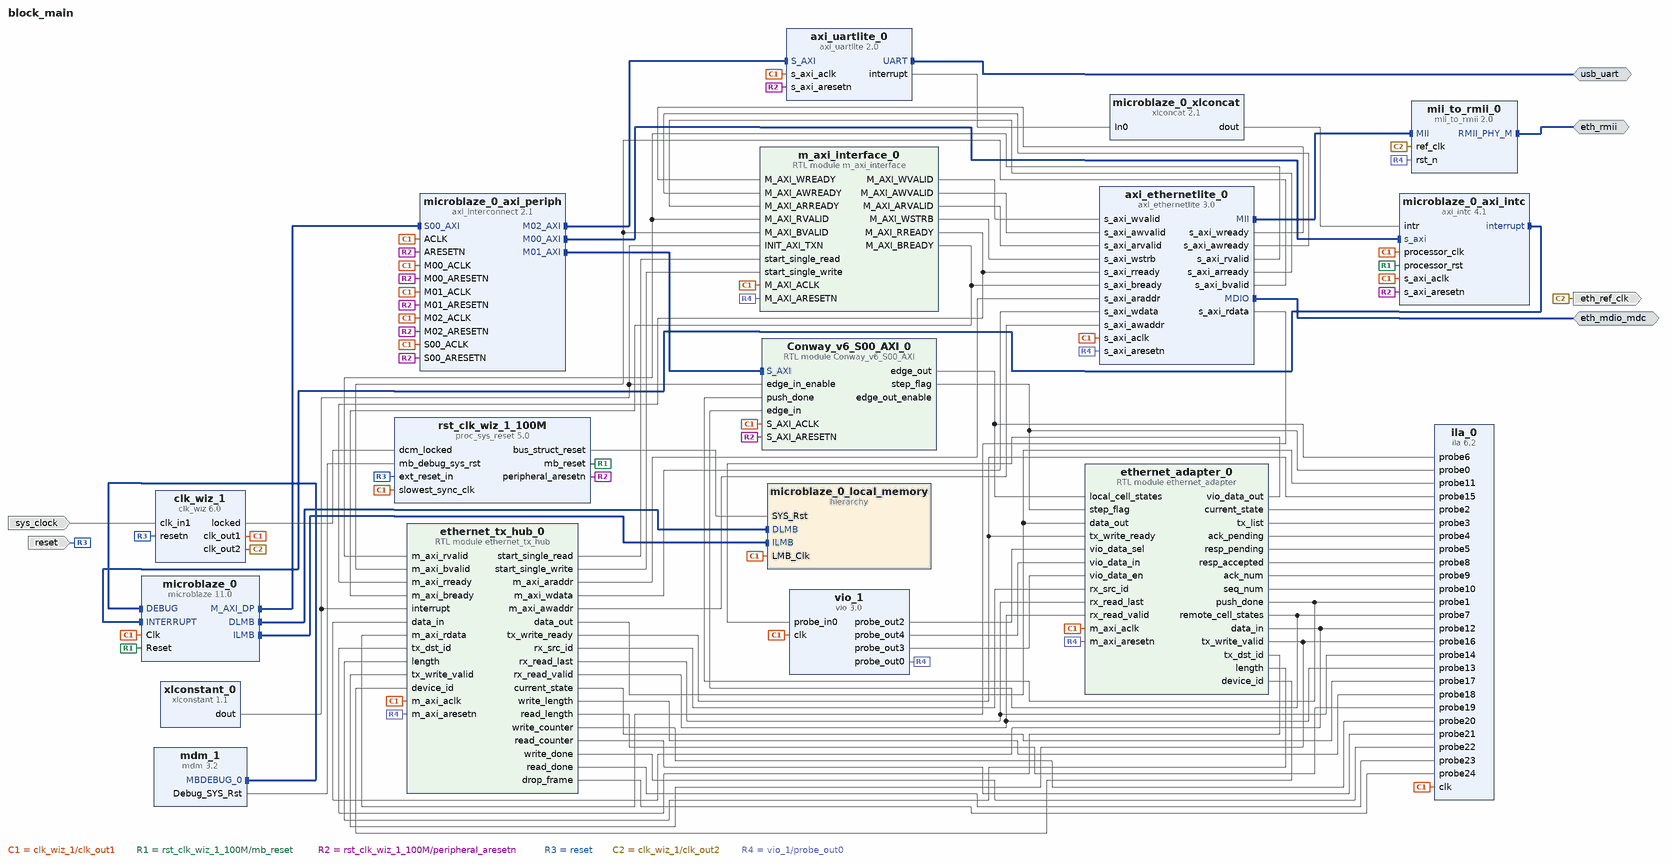
[diagram p0: block diagram of the top level]
# Vivado block design block_main, xc7a100tcsg324-1, Vivado 2018.3.1
create_bd_design block_main

create_bd_intf_port -mode Master -vlnv xilinx.com:interface:uart_rtl:1.0 usb_uart
create_bd_intf_port -mode Master -vlnv xilinx.com:interface:mdio_rtl:1.0 eth_mdio_mdc
create_bd_intf_port -mode Master -vlnv xilinx.com:interface:rmii_rtl:1.0 eth_rmii
create_bd_port -dir I -type rst reset
set_property -dict {CONFIG.POLARITY ACTIVE_LOW} [get_bd_ports reset]
create_bd_port -dir I -type clk sys_clock
set_property -dict {CONFIG.FREQ_HZ 100000000 CONFIG.PHASE 0.000} [get_bd_ports sys_clock]
create_bd_port -dir O -type clk eth_ref_clk

create_bd_cell -type ip -vlnv xilinx.com:ip:microblaze:11.0 microblaze_0
set_property -dict {CONFIG.C_DEBUG_ENABLED 1 CONFIG.C_D_AXI 1 CONFIG.C_D_LMB 1 CONFIG.C_I_LMB 1} [get_bd_cells microblaze_0]
create_bd_cell -type hier microblaze_0_local_memory
create_bd_cell -type ip -vlnv xilinx.com:ip:axi_interconnect:2.1 microblaze_0_axi_periph
set_property -dict {CONFIG.NUM_MI 3} [get_bd_cells microblaze_0_axi_periph]
create_bd_cell -type ip -vlnv xilinx.com:ip:axi_intc:4.1 microblaze_0_axi_intc
set_property -dict {CONFIG.C_HAS_FAST 1} [get_bd_cells microblaze_0_axi_intc]
create_bd_cell -type ip -vlnv xilinx.com:ip:xlconcat:2.1 microblaze_0_xlconcat
set_property -dict {CONFIG.NUM_PORTS 1} [get_bd_cells microblaze_0_xlconcat]
create_bd_cell -type ip -vlnv xilinx.com:ip:mdm:3.2 mdm_1
create_bd_cell -type ip -vlnv xilinx.com:ip:clk_wiz:6.0 clk_wiz_1
set_property -dict [list \
  CONFIG.CLKOUT2_JITTER 151.636 \
  CONFIG.CLKOUT2_PHASE_ERROR 98.575 \
  CONFIG.CLKOUT2_REQUESTED_OUT_FREQ 50.000 \
  CONFIG.CLKOUT2_USED true \
  CONFIG.CLK_IN1_BOARD_INTERFACE sys_clock \
  CONFIG.MMCM_CLKOUT1_DIVIDE 20 \
  CONFIG.MMCM_DIVCLK_DIVIDE 1 \
  CONFIG.NUM_OUT_CLKS 2 \
  CONFIG.PRIM_SOURCE Single_ended_clock_capable_pin \
  CONFIG.RESET_BOARD_INTERFACE reset \
  CONFIG.RESET_PORT resetn \
  CONFIG.RESET_TYPE ACTIVE_LOW \
  CONFIG.USE_BOARD_FLOW true \
] [get_bd_cells clk_wiz_1]
create_bd_cell -type ip -vlnv xilinx.com:ip:proc_sys_reset:5.0 rst_clk_wiz_1_100M
set_property -dict {CONFIG.RESET_BOARD_INTERFACE reset CONFIG.USE_BOARD_FLOW true} [get_bd_cells rst_clk_wiz_1_100M]
create_bd_cell -type ip -vlnv xilinx.com:ip:axi_uartlite:2.0 axi_uartlite_0
set_property -dict {CONFIG.UARTLITE_BOARD_INTERFACE usb_uart CONFIG.USE_BOARD_FLOW true} [get_bd_cells axi_uartlite_0]
create_bd_cell -type module -reference ethernet_tx_hub ethernet_tx_hub_0
create_bd_cell -type module -reference m_axi_interface m_axi_interface_0
create_bd_cell -type ip -vlnv xilinx.com:ip:axi_ethernetlite:3.0 axi_ethernetlite_0
set_property -dict [list \
  CONFIG.C_RX_PING_PONG 0 \
  CONFIG.C_TX_PING_PONG 0 \
  CONFIG.MDIO_BOARD_INTERFACE eth_mdio_mdc \
] [get_bd_cells axi_ethernetlite_0]
create_bd_cell -type ip -vlnv xilinx.com:ip:mii_to_rmii:2.0 mii_to_rmii_0
set_property -dict [list \
  CONFIG.REF_CLK_BOARD_INTERFACE sys_clock \
  CONFIG.RESET_BOARD_INTERFACE reset \
  CONFIG.RMII_BOARD_INTERFACE eth_rmii \
] [get_bd_cells mii_to_rmii_0]
create_bd_cell -type ip -vlnv xilinx.com:ip:vio:3.0 vio_1
set_property -dict [list \
  CONFIG.C_NUM_PROBE_OUT 5 \
  CONFIG.C_PROBE_OUT1_WIDTH 8 \
  CONFIG.C_PROBE_OUT2_WIDTH 4 \
  CONFIG.C_PROBE_OUT4_WIDTH 6 \
] [get_bd_cells vio_1]
create_bd_cell -type ip -vlnv xilinx.com:ip:xlconstant:1.1 xlconstant_0
set_property -dict {CONFIG.CONST_VAL 0} [get_bd_cells xlconstant_0]
create_bd_cell -type ip -vlnv xilinx.com:ip:ila:6.2 ila_0
set_property -dict [list \
  CONFIG.C_ENABLE_ILA_AXI_MON false \
  CONFIG.C_MONITOR_TYPE Native \
  CONFIG.C_NUM_OF_PROBES 25 \
  CONFIG.C_PROBE10_WIDTH 8 \
  CONFIG.C_PROBE11_WIDTH 32 \
  CONFIG.C_PROBE12_WIDTH 32 \
  CONFIG.C_PROBE17_WIDTH 4 \
  CONFIG.C_PROBE18_WIDTH 11 \
  CONFIG.C_PROBE19_WIDTH 11 \
  CONFIG.C_PROBE20_WIDTH 11 \
  CONFIG.C_PROBE21_WIDTH 13 \
  CONFIG.C_PROBE2_WIDTH 4 \
  CONFIG.C_PROBE3_WIDTH 8 \
  CONFIG.C_PROBE4_WIDTH 8 \
  CONFIG.C_PROBE6_WIDTH 10 \
  CONFIG.C_PROBE7_WIDTH 10 \
  CONFIG.C_PROBE9_WIDTH 8 \
] [get_bd_cells ila_0]
create_bd_cell -type module -reference Conway_v6_S00_AXI Conway_v6_S00_AXI_0
create_bd_cell -type module -reference ethernet_adapter ethernet_adapter_0

# ---- hierarchy /microblaze_0_local_memory ----
current_bd_instance /microblaze_0_local_memory
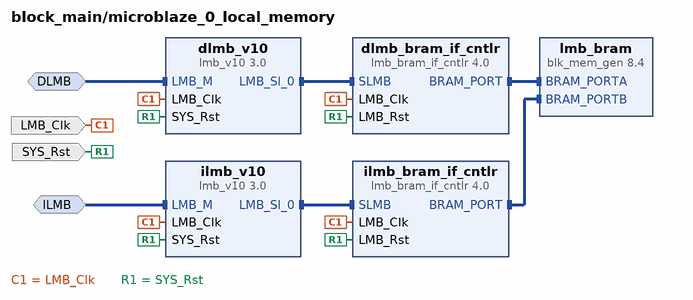
[diagram p1: block diagram inside /microblaze_0_local_memory]
create_bd_intf_pin -mode MirroredMaster -vlnv xilinx.com:interface:lmb_rtl:1.0 DLMB
create_bd_intf_pin -mode MirroredMaster -vlnv xilinx.com:interface:lmb_rtl:1.0 ILMB
create_bd_pin -dir I -type clk LMB_Clk
create_bd_pin -dir I -type rst SYS_Rst

create_bd_cell -type ip -vlnv xilinx.com:ip:lmb_v10:3.0 dlmb_v10
create_bd_cell -type ip -vlnv xilinx.com:ip:lmb_v10:3.0 ilmb_v10
create_bd_cell -type ip -vlnv xilinx.com:ip:lmb_bram_if_cntlr:4.0 dlmb_bram_if_cntlr
set_property -dict {CONFIG.C_ECC 0} [get_bd_cells dlmb_bram_if_cntlr]
create_bd_cell -type ip -vlnv xilinx.com:ip:lmb_bram_if_cntlr:4.0 ilmb_bram_if_cntlr
set_property -dict {CONFIG.C_ECC 0} [get_bd_cells ilmb_bram_if_cntlr]
create_bd_cell -type ip -vlnv xilinx.com:ip:blk_mem_gen:8.4 lmb_bram
set_property -dict {CONFIG.Memory_Type True_Dual_Port_RAM CONFIG.use_bram_block BRAM_Controller} [get_bd_cells lmb_bram]

# ---- connections ----

current_bd_instance /microblaze_0_local_memory
connect_bd_intf_net -intf_net microblaze_0_dlmb_cntlr [get_bd_intf_pins dlmb_bram_if_cntlr/BRAM_PORT] [get_bd_intf_pins lmb_bram/BRAM_PORTA]
connect_bd_intf_net -intf_net microblaze_0_ilmb_cntlr [get_bd_intf_pins ilmb_bram_if_cntlr/BRAM_PORT] [get_bd_intf_pins lmb_bram/BRAM_PORTB]
connect_bd_intf_net -intf_net microblaze_0_dlmb [get_bd_intf_pins DLMB] [get_bd_intf_pins dlmb_v10/LMB_M]
connect_bd_intf_net -intf_net microblaze_0_ilmb [get_bd_intf_pins ILMB] [get_bd_intf_pins ilmb_v10/LMB_M]
connect_bd_intf_net -intf_net microblaze_0_dlmb_bus [get_bd_intf_pins dlmb_v10/LMB_Sl_0] [get_bd_intf_pins dlmb_bram_if_cntlr/SLMB]
connect_bd_intf_net -intf_net microblaze_0_ilmb_bus [get_bd_intf_pins ilmb_v10/LMB_Sl_0] [get_bd_intf_pins ilmb_bram_if_cntlr/SLMB]
connect_bd_net -net microblaze_0_Clk [get_bd_pins LMB_Clk] \
  [get_bd_pins dlmb_v10/LMB_Clk] [get_bd_pins dlmb_bram_if_cntlr/LMB_Clk] [get_bd_pins ilmb_v10/LMB_Clk] \
  [get_bd_pins ilmb_bram_if_cntlr/LMB_Clk]
connect_bd_net [get_bd_pins SYS_Rst] \
  [get_bd_pins dlmb_v10/SYS_Rst] [get_bd_pins dlmb_bram_if_cntlr/LMB_Rst] [get_bd_pins ilmb_v10/SYS_Rst] \
  [get_bd_pins ilmb_bram_if_cntlr/LMB_Rst]
set_property HDL_ATTRIBUTE.BMM_INFO_ADDRESS_SPACE {byte  0x00000000 32 > block_main microblaze_0_local_memory/lmb_bram} [get_bd_cells dlmb_bram_if_cntlr]
set_property HDL_ATTRIBUTE.KEEP_HIERARCHY yes [get_bd_cells dlmb_bram_if_cntlr]

current_bd_instance /
connect_bd_intf_net [get_bd_intf_pins microblaze_0_axi_periph/M02_AXI] [get_bd_intf_pins axi_uartlite_0/S_AXI]
connect_bd_intf_net [get_bd_intf_ports usb_uart] [get_bd_intf_pins axi_uartlite_0/UART]
connect_bd_intf_net [get_bd_intf_pins axi_ethernetlite_0/MII] [get_bd_intf_pins mii_to_rmii_0/MII]
connect_bd_intf_net [get_bd_intf_ports eth_rmii] [get_bd_intf_pins mii_to_rmii_0/RMII_PHY_M]
connect_bd_intf_net [get_bd_intf_pins microblaze_0_axi_intc/interrupt] [get_bd_intf_pins microblaze_0/INTERRUPT]
connect_bd_intf_net [get_bd_intf_pins microblaze_0/DLMB] [get_bd_intf_pins microblaze_0_local_memory/DLMB]
connect_bd_intf_net [get_bd_intf_pins mdm_1/MBDEBUG_0] [get_bd_intf_pins microblaze_0/DEBUG]
connect_bd_intf_net -intf_net microblaze_0_intc_axi [get_bd_intf_pins microblaze_0_axi_periph/M00_AXI] [get_bd_intf_pins microblaze_0_axi_intc/s_axi]
connect_bd_intf_net [get_bd_intf_pins microblaze_0_axi_periph/M01_AXI] [get_bd_intf_pins Conway_v6_S00_AXI_0/S_AXI]
connect_bd_intf_net [get_bd_intf_ports eth_mdio_mdc] [get_bd_intf_pins axi_ethernetlite_0/MDIO]
connect_bd_intf_net -intf_net microblaze_0_axi_dp [get_bd_intf_pins microblaze_0_axi_periph/S00_AXI] [get_bd_intf_pins microblaze_0/M_AXI_DP]
connect_bd_intf_net [get_bd_intf_pins microblaze_0/ILMB] [get_bd_intf_pins microblaze_0_local_memory/ILMB]
connect_bd_net -net microblaze_0_intr [get_bd_pins microblaze_0_xlconcat/dout] [get_bd_pins microblaze_0_axi_intc/intr]
connect_bd_net -net microblaze_0_Clk [get_bd_pins clk_wiz_1/clk_out1] \
  [get_bd_pins microblaze_0/Clk] [get_bd_pins microblaze_0_axi_periph/ACLK] [get_bd_pins microblaze_0_axi_periph/S00_ACLK] \
  [get_bd_pins microblaze_0_axi_periph/M00_ACLK] [get_bd_pins microblaze_0_axi_intc/s_axi_aclk] \
  [get_bd_pins microblaze_0_axi_intc/processor_clk] [get_bd_pins microblaze_0_local_memory/LMB_Clk] \
  [get_bd_pins rst_clk_wiz_1_100M/slowest_sync_clk] [get_bd_pins microblaze_0_axi_periph/M01_ACLK] \
  [get_bd_pins axi_uartlite_0/s_axi_aclk] [get_bd_pins microblaze_0_axi_periph/M02_ACLK] \
  [get_bd_pins m_axi_interface_0/M_AXI_ACLK] [get_bd_pins ethernet_tx_hub_0/m_axi_aclk] \
  [get_bd_pins axi_ethernetlite_0/s_axi_aclk] [get_bd_pins vio_1/clk] [get_bd_pins ila_0/clk] \
  [get_bd_pins Conway_v6_S00_AXI_0/S_AXI_ACLK] [get_bd_pins ethernet_adapter_0/m_axi_aclk]
connect_bd_net [get_bd_pins clk_wiz_1/locked] [get_bd_pins rst_clk_wiz_1_100M/dcm_locked]
connect_bd_net [get_bd_pins rst_clk_wiz_1_100M/mb_reset] [get_bd_pins microblaze_0/Reset] [get_bd_pins microblaze_0_axi_intc/processor_rst]
connect_bd_net [get_bd_pins rst_clk_wiz_1_100M/bus_struct_reset] [get_bd_pins microblaze_0_local_memory/SYS_Rst]
connect_bd_net [get_bd_pins rst_clk_wiz_1_100M/peripheral_aresetn] \
  [get_bd_pins microblaze_0_axi_periph/ARESETN] [get_bd_pins microblaze_0_axi_periph/S00_ARESETN] \
  [get_bd_pins microblaze_0_axi_periph/M00_ARESETN] [get_bd_pins microblaze_0_axi_intc/s_axi_aresetn] \
  [get_bd_pins microblaze_0_axi_periph/M01_ARESETN] [get_bd_pins axi_uartlite_0/s_axi_aresetn] \
  [get_bd_pins microblaze_0_axi_periph/M02_ARESETN] [get_bd_pins Conway_v6_S00_AXI_0/S_AXI_ARESETN]
connect_bd_net [get_bd_pins mdm_1/Debug_SYS_Rst] [get_bd_pins rst_clk_wiz_1_100M/mb_debug_sys_rst]
connect_bd_net [get_bd_ports reset] [get_bd_pins clk_wiz_1/resetn] [get_bd_pins rst_clk_wiz_1_100M/ext_reset_in]
connect_bd_net [get_bd_pins axi_uartlite_0/interrupt] [get_bd_pins microblaze_0_xlconcat/In0]
connect_bd_net [get_bd_ports sys_clock] [get_bd_pins clk_wiz_1/clk_in1]
connect_bd_net [get_bd_pins ethernet_tx_hub_0/data_out] [get_bd_pins ila_0/probe11] [get_bd_pins ethernet_adapter_0/data_out]
connect_bd_net [get_bd_pins ethernet_adapter_0/data_in] [get_bd_pins ethernet_tx_hub_0/data_in] [get_bd_pins ila_0/probe12]
connect_bd_net [get_bd_pins ethernet_adapter_0/tx_dst_id] [get_bd_pins ethernet_tx_hub_0/tx_dst_id]
connect_bd_net [get_bd_pins ethernet_tx_hub_0/rx_src_id] [get_bd_pins ethernet_adapter_0/rx_src_id]
connect_bd_net [get_bd_pins ethernet_tx_hub_0/start_single_read] [get_bd_pins m_axi_interface_0/start_single_read]
connect_bd_net [get_bd_pins ethernet_tx_hub_0/start_single_write] [get_bd_pins m_axi_interface_0/start_single_write]
connect_bd_net [get_bd_pins ethernet_tx_hub_0/tx_write_ready] [get_bd_pins ila_0/probe15] [get_bd_pins ethernet_adapter_0/tx_write_ready]
connect_bd_net [get_bd_pins ethernet_tx_hub_0/rx_read_last] [get_bd_pins ila_0/probe14] [get_bd_pins ethernet_adapter_0/rx_read_last]
connect_bd_net [get_bd_pins ethernet_tx_hub_0/rx_read_valid] [get_bd_pins ila_0/probe13] [get_bd_pins ethernet_adapter_0/rx_read_valid]
connect_bd_net [get_bd_pins ethernet_adapter_0/length] [get_bd_pins ethernet_tx_hub_0/length]
connect_bd_net [get_bd_pins ethernet_adapter_0/tx_write_valid] [get_bd_pins ethernet_tx_hub_0/tx_write_valid] [get_bd_pins ila_0/probe16]
connect_bd_net [get_bd_pins ethernet_adapter_0/device_id] [get_bd_pins ethernet_tx_hub_0/device_id]
connect_bd_net [get_bd_pins m_axi_interface_0/M_AXI_RREADY] [get_bd_pins ethernet_tx_hub_0/m_axi_rready] [get_bd_pins axi_ethernetlite_0/s_axi_rready]
connect_bd_net [get_bd_pins axi_ethernetlite_0/s_axi_rvalid] [get_bd_pins ethernet_tx_hub_0/m_axi_rvalid] [get_bd_pins m_axi_interface_0/M_AXI_RVALID]
connect_bd_net [get_bd_pins m_axi_interface_0/M_AXI_BREADY] [get_bd_pins ethernet_tx_hub_0/m_axi_bready] [get_bd_pins axi_ethernetlite_0/s_axi_bready]
connect_bd_net [get_bd_pins axi_ethernetlite_0/s_axi_bvalid] [get_bd_pins ethernet_tx_hub_0/m_axi_bvalid] [get_bd_pins m_axi_interface_0/M_AXI_BVALID]
connect_bd_net [get_bd_pins ethernet_tx_hub_0/m_axi_araddr] [get_bd_pins axi_ethernetlite_0/s_axi_araddr]
connect_bd_net [get_bd_pins ethernet_tx_hub_0/m_axi_wdata] [get_bd_pins axi_ethernetlite_0/s_axi_wdata]
connect_bd_net [get_bd_pins ethernet_tx_hub_0/m_axi_awaddr] [get_bd_pins axi_ethernetlite_0/s_axi_awaddr]
connect_bd_net [get_bd_pins m_axi_interface_0/M_AXI_WVALID] [get_bd_pins axi_ethernetlite_0/s_axi_wvalid]
connect_bd_net [get_bd_pins axi_ethernetlite_0/s_axi_wready] [get_bd_pins m_axi_interface_0/M_AXI_WREADY]
connect_bd_net [get_bd_pins m_axi_interface_0/M_AXI_AWVALID] [get_bd_pins axi_ethernetlite_0/s_axi_awvalid]
connect_bd_net [get_bd_pins axi_ethernetlite_0/s_axi_awready] [get_bd_pins m_axi_interface_0/M_AXI_AWREADY]
connect_bd_net [get_bd_pins axi_ethernetlite_0/s_axi_arready] [get_bd_pins m_axi_interface_0/M_AXI_ARREADY]
connect_bd_net [get_bd_pins m_axi_interface_0/M_AXI_ARVALID] [get_bd_pins axi_ethernetlite_0/s_axi_arvalid]
connect_bd_net [get_bd_pins axi_ethernetlite_0/s_axi_rdata] [get_bd_pins ethernet_tx_hub_0/m_axi_rdata]
connect_bd_net [get_bd_pins m_axi_interface_0/M_AXI_WSTRB] [get_bd_pins axi_ethernetlite_0/s_axi_wstrb]
connect_bd_net [get_bd_pins clk_wiz_1/clk_out2] [get_bd_pins mii_to_rmii_0/ref_clk] [get_bd_ports eth_ref_clk]
connect_bd_net [get_bd_pins vio_1/probe_out0] \
  [get_bd_pins m_axi_interface_0/M_AXI_ARESETN] [get_bd_pins mii_to_rmii_0/rst_n] \
  [get_bd_pins axi_ethernetlite_0/s_axi_aresetn] [get_bd_pins ethernet_tx_hub_0/m_axi_aresetn] \
  [get_bd_pins ethernet_adapter_0/m_axi_aresetn]
connect_bd_net [get_bd_pins ethernet_adapter_0/vio_data_out] [get_bd_pins vio_1/probe_in0]
connect_bd_net [get_bd_pins vio_1/probe_out2] [get_bd_pins ethernet_adapter_0/vio_data_sel]
connect_bd_net [get_bd_pins vio_1/probe_out4] [get_bd_pins ethernet_adapter_0/vio_data_in]
connect_bd_net [get_bd_pins vio_1/probe_out3] [get_bd_pins ethernet_adapter_0/vio_data_en]
# net Conway_v6_S00_AXI_0_edge_out_enable has one end: Conway_v6_S00_AXI_0/edge_out_enable
connect_bd_net [get_bd_pins Conway_v6_S00_AXI_0/edge_out] [get_bd_pins ila_0/probe6] [get_bd_pins ethernet_adapter_0/local_cell_states]
connect_bd_net [get_bd_pins ethernet_adapter_0/push_done] [get_bd_pins ila_0/probe1] [get_bd_pins Conway_v6_S00_AXI_0/push_done]
connect_bd_net [get_bd_pins ethernet_adapter_0/remote_cell_states] [get_bd_pins ila_0/probe7] [get_bd_pins Conway_v6_S00_AXI_0/edge_in]
connect_bd_net [get_bd_pins Conway_v6_S00_AXI_0/step_flag] [get_bd_pins ila_0/probe0] [get_bd_pins ethernet_adapter_0/step_flag]
connect_bd_net [get_bd_pins xlconstant_0/dout] \
  [get_bd_pins ethernet_tx_hub_0/interrupt] [get_bd_pins m_axi_interface_0/INIT_AXI_TXN] \
  [get_bd_pins Conway_v6_S00_AXI_0/edge_in_enable]
connect_bd_net [get_bd_pins ethernet_adapter_0/current_state] [get_bd_pins ila_0/probe2]
connect_bd_net [get_bd_pins ethernet_adapter_0/tx_list] [get_bd_pins ila_0/probe3]
connect_bd_net [get_bd_pins ethernet_adapter_0/ack_pending] [get_bd_pins ila_0/probe4]
connect_bd_net [get_bd_pins ethernet_adapter_0/resp_pending] [get_bd_pins ila_0/probe5]
connect_bd_net [get_bd_pins ethernet_adapter_0/resp_accepted] [get_bd_pins ila_0/probe8]
connect_bd_net [get_bd_pins ethernet_adapter_0/ack_num] [get_bd_pins ila_0/probe9]
connect_bd_net [get_bd_pins ethernet_adapter_0/seq_num] [get_bd_pins ila_0/probe10]
connect_bd_net [get_bd_pins ethernet_tx_hub_0/current_state] [get_bd_pins ila_0/probe17]
connect_bd_net [get_bd_pins ethernet_tx_hub_0/write_length] [get_bd_pins ila_0/probe18]
connect_bd_net [get_bd_pins ethernet_tx_hub_0/read_length] [get_bd_pins ila_0/probe19]
connect_bd_net [get_bd_pins ethernet_tx_hub_0/write_counter] [get_bd_pins ila_0/probe20]
connect_bd_net [get_bd_pins ethernet_tx_hub_0/read_counter] [get_bd_pins ila_0/probe21]
connect_bd_net [get_bd_pins ethernet_tx_hub_0/write_done] [get_bd_pins ila_0/probe22]
connect_bd_net [get_bd_pins ethernet_tx_hub_0/read_done] [get_bd_pins ila_0/probe23]
connect_bd_net [get_bd_pins ethernet_tx_hub_0/drop_frame] [get_bd_pins ila_0/probe24]
set_property HDL_ATTRIBUTE.BMM_INFO_PROCESSOR {microblaze-le > block_main microblaze_0_local_memory/dlmb_bram_if_cntlr} [get_bd_cells microblaze_0]
set_property HDL_ATTRIBUTE.KEEP_HIERARCHY yes [get_bd_cells microblaze_0]

# ---- address map ----
assign_bd_address -offset 0x00000000 -range 64K -target_address_space [get_bd_addr_spaces microblaze_0/Data] [get_bd_addr_segs microblaze_0_local_memory/dlmb_bram_if_cntlr/SLMB/Mem]
assign_bd_address -offset 0x40600000 -range 64K -target_address_space [get_bd_addr_spaces microblaze_0/Data] [get_bd_addr_segs axi_uartlite_0/S_AXI/Reg]
assign_bd_address -offset 0x41200000 -range 64K -target_address_space [get_bd_addr_spaces microblaze_0/Data] [get_bd_addr_segs microblaze_0_axi_intc/S_AXI/Reg]
assign_bd_address -offset 0x44A00000 -range 64K -target_address_space [get_bd_addr_spaces microblaze_0/Data] [get_bd_addr_segs Conway_v6_S00_AXI_0/S_AXI/reg0]
assign_bd_address -offset 0x00000000 -range 64K -target_address_space [get_bd_addr_spaces microblaze_0/Instruction] [get_bd_addr_segs microblaze_0_local_memory/ilmb_bram_if_cntlr/SLMB/Mem]

validate_bd_design
save_bd_design
